# Altium schematic sheet ESP32_BLE.SchDoc: BluetoothGateway
size A; DrawnBy: Q.Thang & T.Khoa; Revision: V1.0.0; SheetNumber: 6; SheetTotal: 17
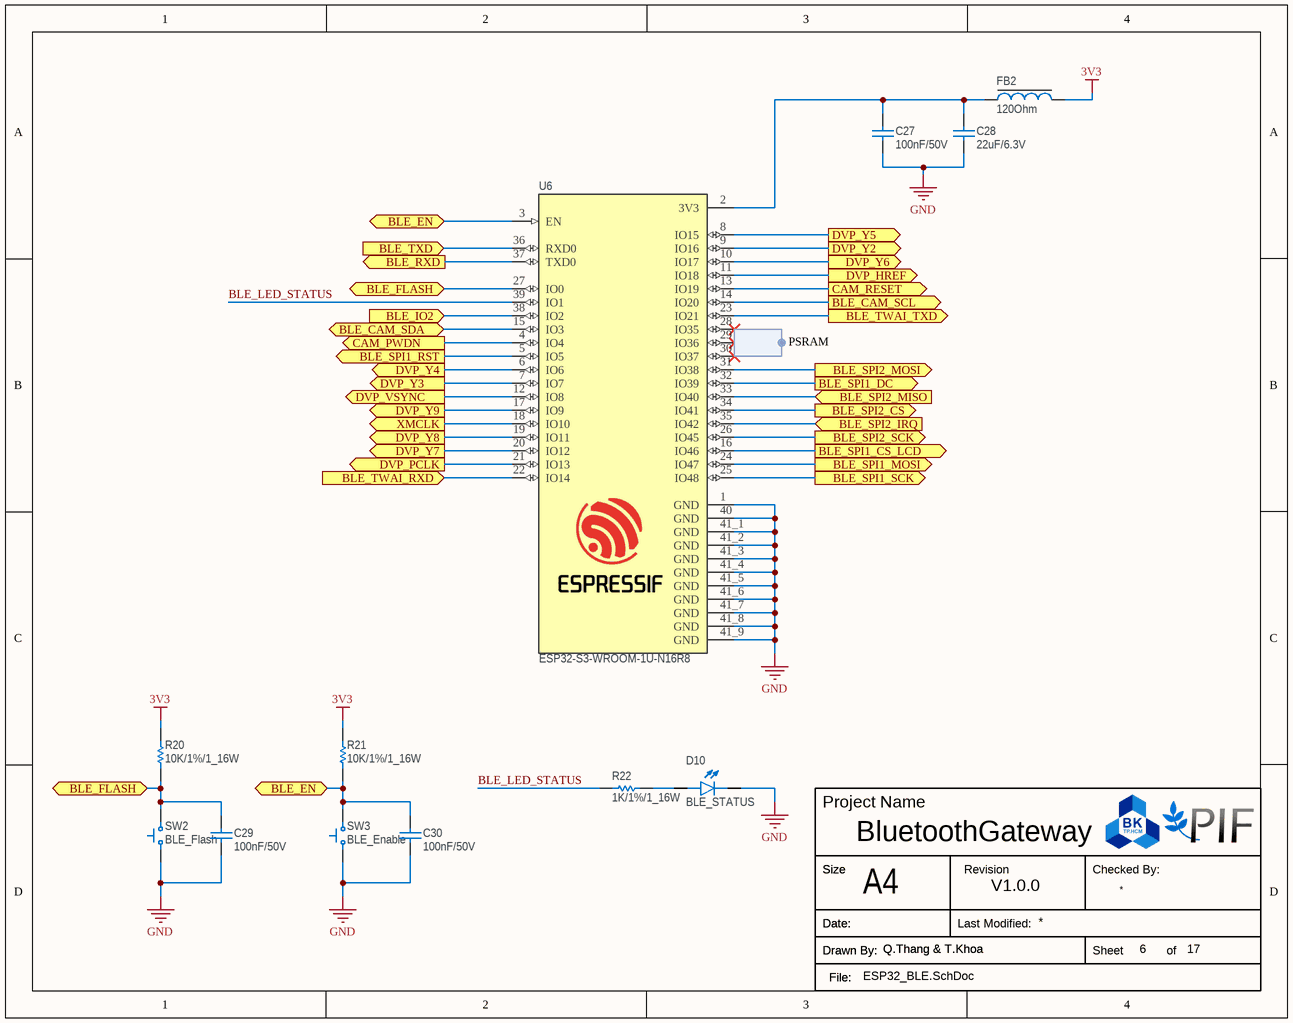
[diagram p0: ESP32_BLE.SchDoc]

## Parts
C27  100nF/50V  [CAP_0805]
C28  22uF/6.3V  [CAP_0805]
C29  100nF/50V  [CAP_0402]
C30  100nF/50V  [CAP_0402]
D10  BLE_STATUS  [LED_0603Y]
FB2  120Ohm  [Ferrite_Bead_0805]
R20  10K/1%/1_16W  [RESISTOR_0402]
R21  10K/1%/1_16W  [RESISTOR_0402]
R22  1K/1%/1_16W  [RESISTOR_0402]
SW2  BLE_Flash  [Button_3x4mm_SMD_2P]
SW3  BLE_Enable  [Button_3x4mm_SMD_2P]
U6  ESP32-S3-WROOM-1U-N16R8  [XCVR_ESP32-S3-WROOM-1U-N16R8]

## Ports
BLE_CAM_SCL (out, see Overview_Schematic[3B], Camera[2B]), BLE_CAM_SDA (bidir, see Overview_Schematic[3B], Camera[2B]), BLE_EN (bidir, see Overview_Schematic[3A], USB_To_TTL[4B]), BLE_FLASH (bidir, see Overview_Schematic[4A], USB_To_TTL[4B]), BLE_IO2 (in, see Overview_Schematic[3A], USB_To_TTL[4B]), BLE_RXD (out, see Overview_Schematic[3A], USB_To_TTL[6A]), BLE_SPI1_CS_LCD (out, see Overview_Schematic[3C], Display[2A]), BLE_SPI1_DC (out, see Overview_Schematic[3C], Display[2B]), BLE_SPI1_MOSI (out, see Overview_Schematic[3C], Display[2B]), BLE_SPI1_RST (out, see Overview_Schematic[3C], Display[2B]), BLE_SPI1_SCK (out, see Overview_Schematic[3C], Display[2B]), BLE_SPI2_CS (out, see Overview_Schematic[3C], Display[2B]), BLE_SPI2_IRQ (in, see Overview_Schematic[3C], Display[2B]), BLE_SPI2_MISO (in, see Overview_Schematic[3C], Display[2B]), BLE_SPI2_MOSI (out, see Overview_Schematic[3C], Display[2B]), BLE_SPI2_SCK (out, see Overview_Schematic[3C], Display[2B]), BLE_TWAI_RXD (in, see Overview_Schematic[4B]), BLE_TWAI_TXD (out, see Overview_Schematic[4B]), BLE_TXD (in, see Overview_Schematic[3A], USB_To_TTL[6A]), CAM_PWDN (out, see Overview_Schematic[3B], Camera[2B]), CAM_RESET (out, see Overview_Schematic[3B], Camera[2B]), DVP_HREF (out, see Overview_Schematic[3B], Camera[3B]), DVP_PCLK (out, see Overview_Schematic[3B], Camera[3B]), DVP_VSYNC (out, see Overview_Schematic[3B], Camera[3B]), DVP_Y2 (out, see Overview_Schematic[3B], Camera[3C]), DVP_Y3 (out, see Overview_Schematic[3B], Camera[3C]), DVP_Y4 (out, see Overview_Schematic[3B], Camera[3C]), DVP_Y5 (out, see Overview_Schematic[3B], Camera[3C]), DVP_Y6 (out, see Overview_Schematic[3B], Camera[3B]), DVP_Y7 (out, see Overview_Schematic[3B], Camera[3B]), DVP_Y8 (out, see Overview_Schematic[3B], Camera[3B]), DVP_Y9 (out, see Overview_Schematic[3B], Camera[3B]), XMCLK (out, see Overview_Schematic[3B], Camera[3B])

## Harnesses
*: 

## Nets
3V3: FB2.2 R20.2 R21.2
GND: C27.1 C28.1 C29.1 C30.1 D10.C SW2.1 SW3.1 U6.1(GND) U6.40(GND) U6.41_1(GND) U6.41_2(GND) U6.41_3(GND) U6.41_4(GND) U6.41_5(GND) U6.41_6(GND) U6.41_7(GND) U6.41_8(GND) U6.41_9(GND)
BLE_CAM_SCL: U6.14(IO20) ; port BLE_CAM_SCL
BLE_CAM_SDA: U6.15(IO3) ; port BLE_CAM_SDA
BLE_EN: C30.2 R21.1 SW3.2 U6.3(EN) ; port BLE_EN
BLE_FLASH: C29.2 R20.1 SW2.2 U6.27(IO0) ; port BLE_FLASH
BLE_IO2: U6.38(IO2) ; port BLE_IO2
BLE_LED_STATUS: R22.1 U6.39(IO1)
BLE_RXD: U6.37(TXD0) ; port BLE_RXD
BLE_SPI1_CS_LCD: U6.16(IO46) ; port BLE_SPI1_CS_LCD
BLE_SPI1_DC: U6.32(IO39) ; port BLE_SPI1_DC
BLE_SPI1_MOSI: U6.24(IO47) ; port BLE_SPI1_MOSI
BLE_SPI1_RST: U6.5(IO5) ; port BLE_SPI1_RST
BLE_SPI1_SCK: U6.25(IO48) ; port BLE_SPI1_SCK
BLE_SPI2_CS: U6.34(IO41) ; port BLE_SPI2_CS
BLE_SPI2_IRQ: U6.35(IO42) ; port BLE_SPI2_IRQ
BLE_SPI2_MISO: U6.33(IO40) ; port BLE_SPI2_MISO
BLE_SPI2_MOSI: U6.31(IO38) ; port BLE_SPI2_MOSI
BLE_SPI2_SCK: U6.26(IO45) ; port BLE_SPI2_SCK
BLE_TWAI_RXD: U6.22(IO14) ; port BLE_TWAI_RXD
BLE_TWAI_TXD: U6.23(IO21) ; port BLE_TWAI_TXD
BLE_TXD: U6.36(RXD0) ; port BLE_TXD
CAM_PWDN: U6.4(IO4) ; port CAM_PWDN
CAM_RESET: U6.13(IO19) ; port CAM_RESET
DVP_HREF: U6.11(IO18) ; port DVP_HREF
DVP_PCLK: U6.21(IO13) ; port DVP_PCLK
DVP_VSYNC: U6.12(IO8) ; port DVP_VSYNC
DVP_Y2: U6.9(IO16) ; port DVP_Y2
DVP_Y3: U6.7(IO7) ; port DVP_Y3
DVP_Y4: U6.6(IO6) ; port DVP_Y4
DVP_Y5: U6.8(IO15) ; port DVP_Y5
DVP_Y6: U6.10(IO17) ; port DVP_Y6
DVP_Y7: U6.20(IO12) ; port DVP_Y7
DVP_Y8: U6.19(IO11) ; port DVP_Y8
DVP_Y9: U6.17(IO9) ; port DVP_Y9
XMCLK: U6.18(IO10) ; port XMCLK
NetC27_2: C27.2 C28.2 FB2.1 U6.2(3V3)
NetD10_A: D10.A R22.2

Not connected (* = marked no-connect by the designer): U6 28(IO35)* 29(IO36)* 30(IO37)*

## Notes on the sheet
- PSRAM
- Project Name
- Size
- A4
- Revision
- Checked By:
- Drawn By:
- Date:
- File:
- Last Modified:
- Sheet
- of

## Library data of the parts
C27 = Ceramic_Cap_100nF_50V_0805: CAP, size 0805, 100nF, 50V; Supply Part Number: Tụ Gốm 0805 100nF (0.1uF) 50V; Supply Name: Thegioiic; Datasheet: *; Supply URL: https://www.thegioiic.com/tu-gom-0805-100nf-0-1uf-50v
C28 = Ceramic_Cap_22uF_6.3V_0805: CAP, size 0805, 22uF, 6.3V; Supply Part Number: Tụ Gốm 0805 22uF 6.3V; Supply Name: Thegioiic; Datasheet: *; Supply URL: https://www.thegioiic.com/tu-gom-0805-22uf-6-3v
C29 C30 = Ceramic_Cap_100nF_50V_0402: CAP, size 0402, 100nF, 50V; Supply Part Number: Tụ Gốm 0402 100nF (0.1uF) 50V; Supply Name: Thegioiic; Datasheet: *; Supply URL: https://www.thegioiic.com/tu-gom-0402-100nf-0-1uf-50v
D10 = LED_Yellow_0603: LED Yellow 0603; Supply Part Number: LED Vàng 0603 Dán SMD Trong Suốt Harvatek; Supply Name: Thegioiic; Supply URL: https://www.thegioiic.com/led-vang-0603-dan-smd-trong-suot-harvatek
FB2 = Ferrite_Bead_120Ohm_2A_0805: Ferrite Bead, size 0805, 120Ohm, 2A; Supply Part Number: CBW201209U121T Ferrite Beads 2A 120 Ohm 0805; Supply Name: Thegioiic; Supply URL: https://www.thegioiic.com/cbw201209u121t-ferrite-beads-2a-120-ohm-0805
R20 R21 = Res_10K_0402_1%: Resistor 0402 10KOhm 1% 1_16W; Supply Part Number: Điện Trở 10 KOhm 0402 1%; Supply Name: Thegioiic; Supply URL: https://www.thegioiic.com/dien-tro-10-kohm-0402-1-
R22 = Res_1K_0402_1%: Resistor 0402 1KOhm 1% 1_16W; Supply Part Number: Điện Trở 1 KOhm 0402 1%; Supply Name: Thegioiic; Supply URL: https://www.thegioiic.com/dien-tro-1-kohm-0402-1-
SW2 SW3 = Button_SMD_3x4mm_2P: Supply Part Number: Nút Nhấn 3x4mm Cao 2.5mm 2 Chân SMD; Supply Name: Thegioiic; Datasheet: *; Supply URL: https://www.thegioiic.com/nut-nhan-3x4mm-cao-2-5mm-2-chan-smd
U6 = ESP32-S3-WROOM-1U-N16R8: Bluetooth, WiFi 802.11b/g/n, Bluetooth v5.0 Transceiver Module 2.4GHz Antenna Not Included, U.FL Surface Mount; Supply Part Number: ESP32-S3-WROOM-1U-N16R8 Thu Phát Wifi BLE ESP32 16MB; Supply Name: DienTuTuyetNga; Datasheet: https://www.espressif.com/sites/default/files/documentation/esp32-s3_datasheet_en.pdf; Supply URL: https://dientutuyetnga.com/products/esp32-s3-wroom-1u-n16r8-thu-phat-wifi-ble-esp32-16mb